# EAGLE schematic Car (EAGLE 7.4.0)
AUTHOR: W. Boyett; REV: A

## Sheet 1 of 4
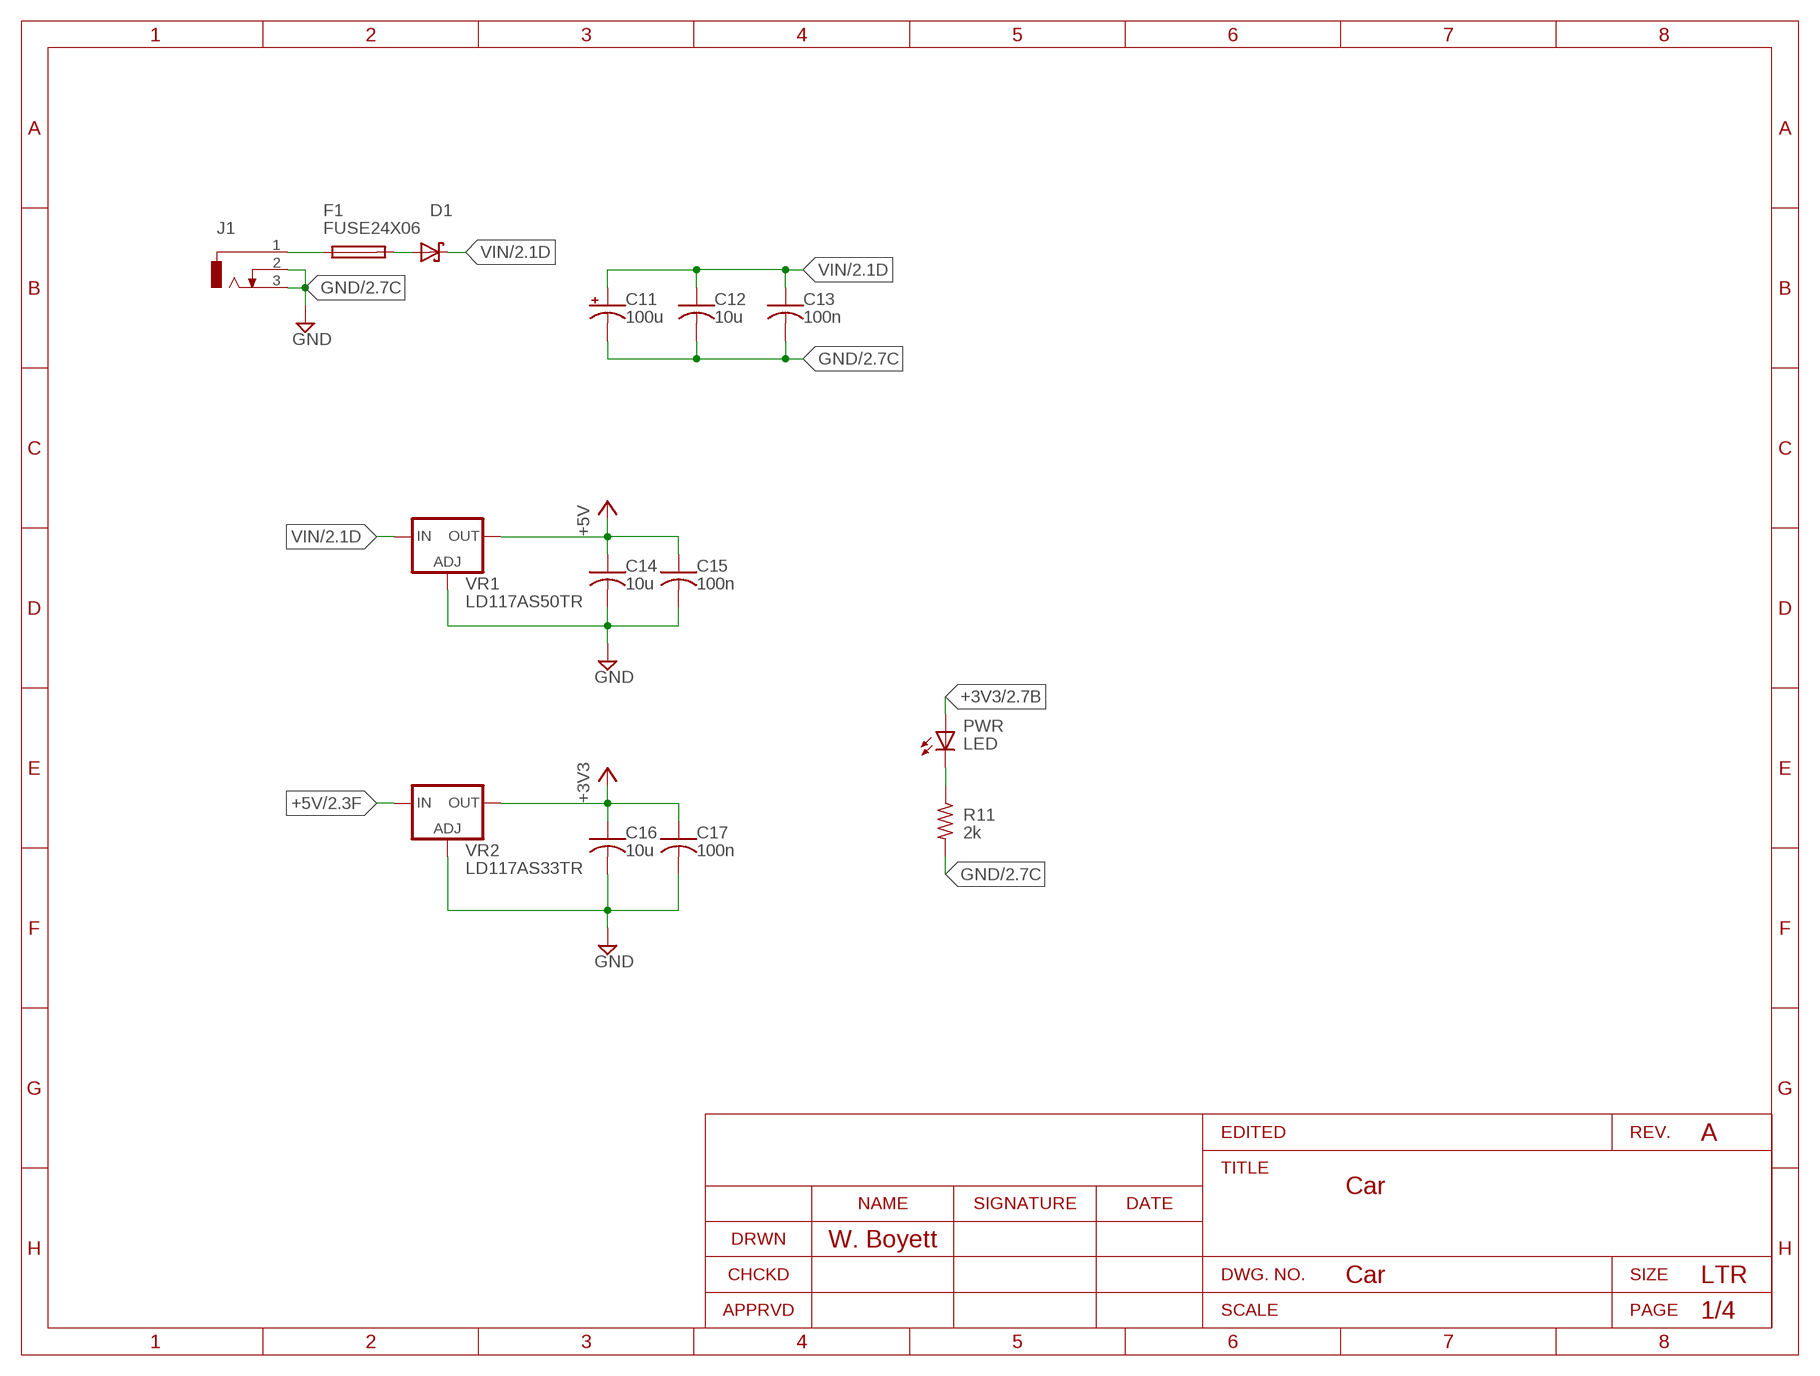
[diagram p0: schematic, sheet 1]
FRAME1 (LETTER_L): SECTION: Power Supply

### Parts
C11  100u  CAP_POLC  [PANASONIC_C]
C12  10u  C-USC1206  [C1206]
C13  100n  C-USC0805  [C0805]
C14  10u  C-USC1206  [C1206]
C15  100n  C-USC0805  [C0805]
C16  10u  C-USC1206  [C1206]
C17  100n  C-USC0805  [C0805]
D1  SCHOTTKY-DIODESMA  [SMA]
F1  FUSE24X06  [2SMD-24X06]
J1  DCJ0303  [DCJ0303]
PWR  LED  LEDCHIP-LED0805  [CHIP-LED0805]
R11  2k  R-US_R0805  [R0805]
VR1  LD117AS50TR  [SOT223]
VR2  LD117AS33TR  [SOT223]

### Nets
+3V3: C16.1 C17.1 PWR.A VR2.2(OUT) VR2.4(OUT) ; also sheet 2,4
+5V: C14.1 C15.1 VR1.2(OUT) VR1.4(OUT) VR2.3(IN) ; also sheet 2,3
GND: C11.- C12.2 C13.2 C14.2 C15.2 C16.2 C17.2 J1.2 J1.3 R11.2 VR1.1(ADJ) VR2.1(ADJ) ; also sheet 2,3,4
N$3: D1.A F1.P$2
N$65: PWR.C R11.1
VIN [power]: C11.+ C12.1 C13.1 D1.C VR1.3(IN) ; also sheet 2,3
VIN_PRF: F1.P$1 J1.1

## Sheet 2 of 4
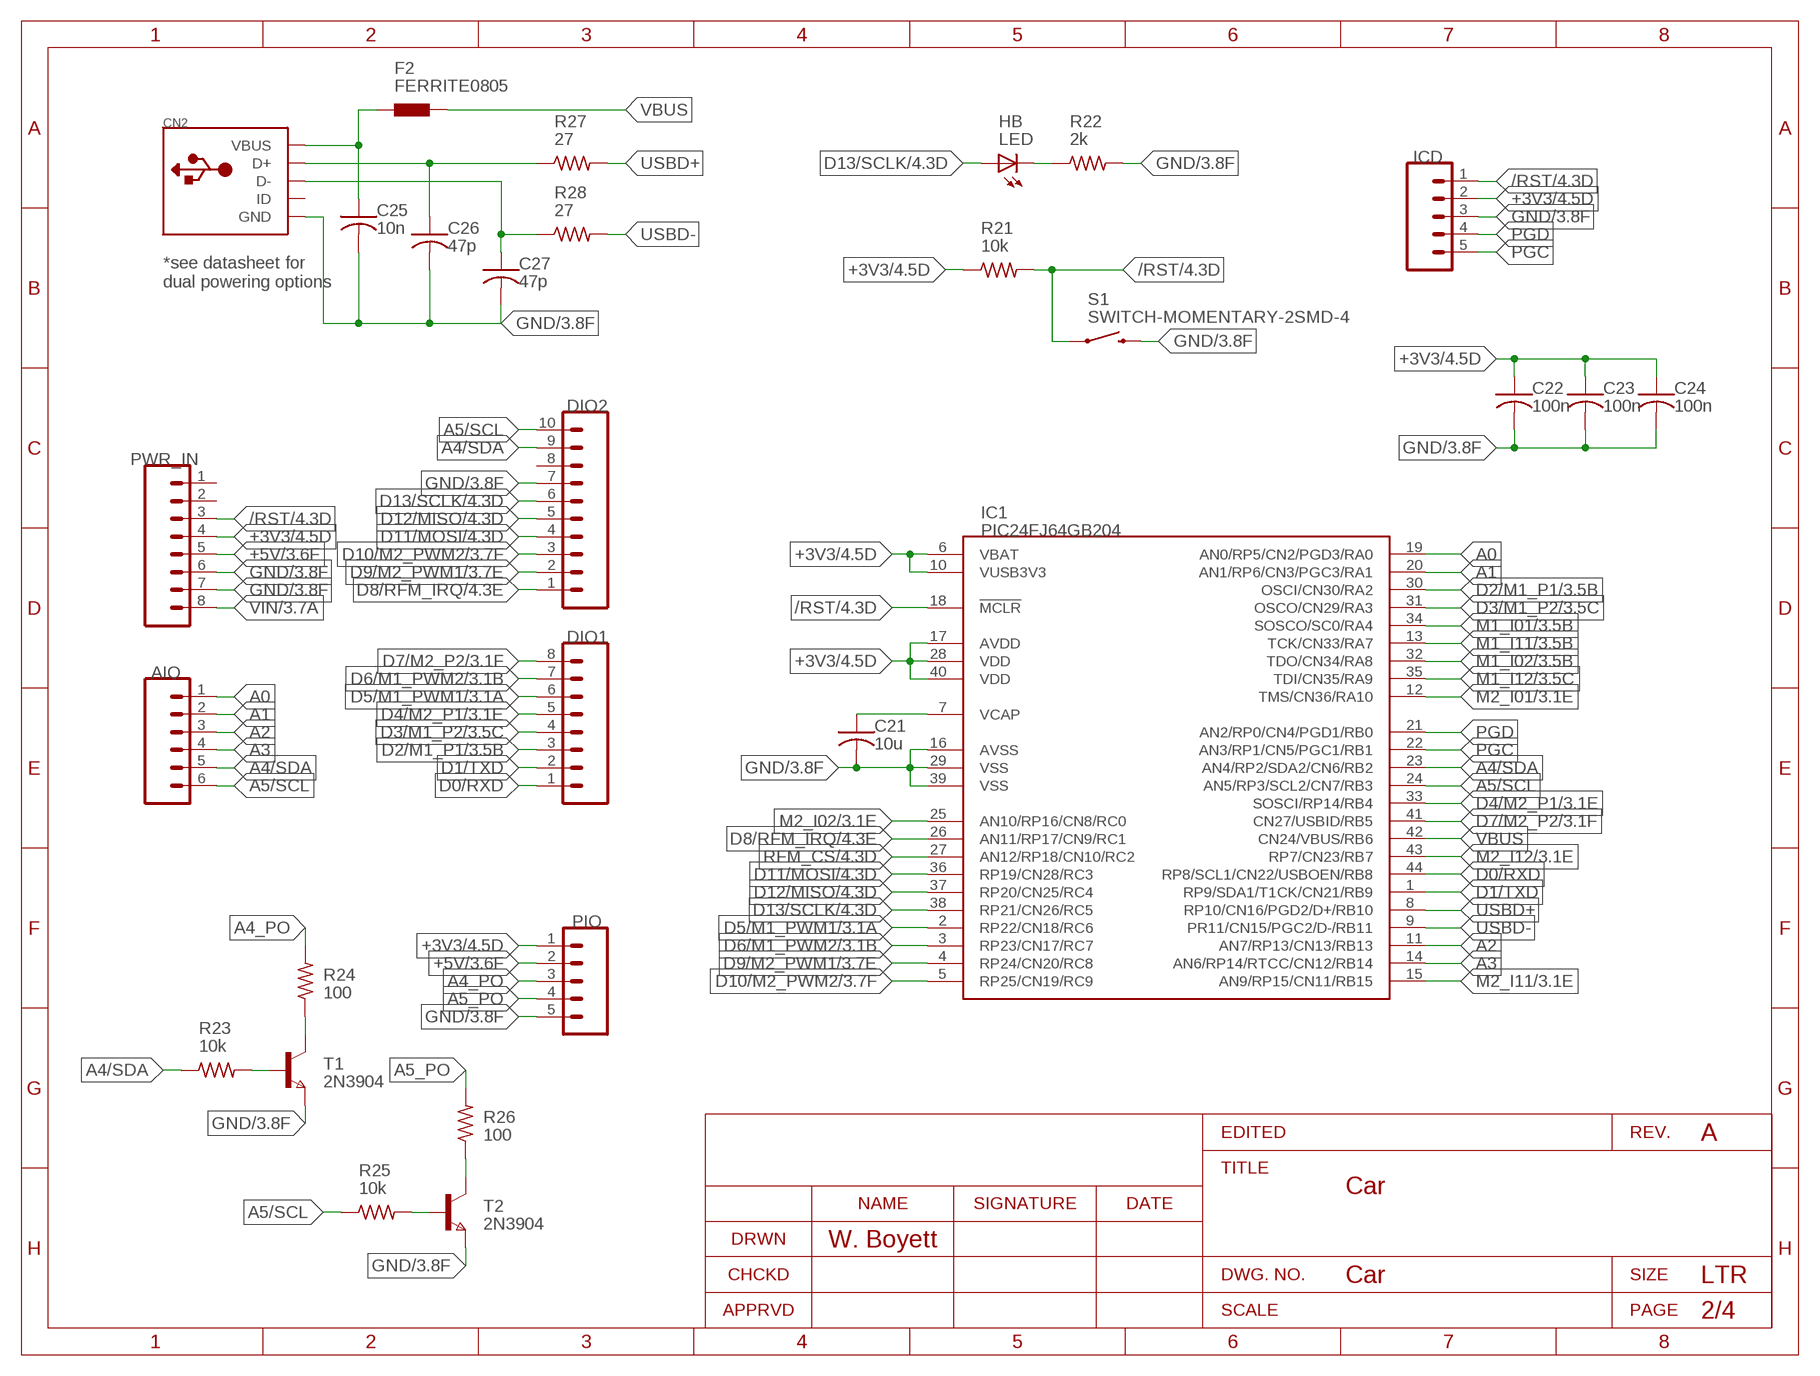
[diagram p1: schematic, sheet 2]
FRAME2 (LETTER_L): SECTION: Microcontroller

### Parts
AIO  M06LOCK  [1X06_LOCK]
C21  10u  C-USC1206  [C1206]
C22  100n  C-USC0805  [C0805]
C23  100n  C-USC0805  [C0805]
C24  100n  C-USC0805  [C0805]
C25  10n  C-USC0805  [C0805]
C26  47p  C-USC0805  [C0805]
C27  47p  C-USC0805  [C0805]
CN2  USBMINIB  [USB-MINIB]
DIO1  M08LOCK  [1X08_LOCK]
DIO2  M10LOCK  [1X10_LOCK]
F2  FERRITE0805  [0805]
HB  LED  LEDCHIP-LED0805  [CHIP-LED0805]
IC1  PIC24FJ64GB204  [TQFP44]
ICD  M05LOCK  [1X05_LOCK]
PIO  M05LOCK  [1X05_LOCK]
PWR_IN  M08LOCK  [1X08_LOCK]
R21  10k  R-US_R0805  [R0805]
R22  2k  R-US_R0805  [R0805]
R23  10k  R-US_R0805  [R0805]
R24  100  R-US_R0805  [R0805]
R25  10k  R-US_R0805  [R0805]
R26  100  R-US_R0805  [R0805]
R27  27  R-US_R0805  [R0805]
R28  27  R-US_R0805  [R0805]
S1  SWITCH-MOMENTARY-2SMD-4  [TACTILE_SWITCH_TALL]
T1  2N3904  NPNSOT23  [SOT-23]
T2  2N3904  NPNSOT23  [SOT-23]

### Nets
+3V3: C22.1 C23.1 C24.1 IC1.6(VBAT) IC1.10(VUSB3V3) IC1.17(AVDD) IC1.28(VDD) IC1.40(VDD) ICD.2 PIO.1 PWR_IN.4 R21.1 ; also sheet 1,4
+5V: PIO.2 PWR_IN.5 ; also sheet 1,3
/RST: IC1.18(!MCLR) ICD.1 PWR_IN.3 R21.2 S1.A2 ; also sheet 4
A0: AIO.1 IC1.19(AN0/RP5/CN2/PGD3/RA0)
A1: AIO.2 IC1.20(AN1/RP6/CN3/PGC3/RA1)
A2: AIO.3 IC1.11(AN7/RP13/CN13/RB13)
A3: AIO.4 IC1.14(AN6/RP14/RTCC/CN12/RB14)
A4/SDA: AIO.5 DIO2.9 IC1.23(AN4/RP2/SDA2/CN6/RB2) R23.1
A4_PO: PIO.3 R24.2
A5/SCL: AIO.6 DIO2.10 IC1.24(AN5/RP3/SCL2/CN7/RB3) R25.1
A5_PO: PIO.4 R26.2
D0/RXD: DIO1.1 IC1.44(RP8/SCL1/CN22/USBOEN/RB8)
D1/TXD: DIO1.2 IC1.1(RP9/SDA1/T1CK/CN21/RB9)
D2/M1_P1: DIO1.3 IC1.30(OSCI/CN30/RA2) ; also sheet 3
D3/M1_P2: DIO1.4 IC1.31(OSCO/CN29/RA3) ; also sheet 3
D4/M2_P1: DIO1.5 IC1.33(SOSCI/RP14/RB4) ; also sheet 3
D5/M1_PWM1: DIO1.6 IC1.2(RP22/CN18/RC6) ; also sheet 3
D6/M1_PWM2: DIO1.7 IC1.3(RP23/CN17/RC7) ; also sheet 3
D7/M2_P2: DIO1.8 IC1.41(CN27/USBID/RB5) ; also sheet 3
D8/RFM_IRQ: DIO2.1 IC1.26(AN11/RP17/CN9/RC1) ; also sheet 4
D9/M2_PWM1: DIO2.2 IC1.4(RP24/CN20/RC8) ; also sheet 3
D10/M2_PWM2: DIO2.3 IC1.5(RP25/CN19/RC9) ; also sheet 3
D11/MOSI: DIO2.4 IC1.36(RP19/CN28/RC3) ; also sheet 4
D12/MISO: DIO2.5 IC1.37(RP20/CN25/RC4) ; also sheet 4
D13/SCLK: DIO2.6 HB.A IC1.38(RP21/CN26/RC5) ; also sheet 4
GND: C21.2 C22.2 C23.2 C24.2 C25.2 C26.2 C27.2 CN2.GND DIO2.7 IC1.16(AVSS) IC1.29(VSS) IC1.39(VSS) ICD.3 PIO.5 PWR_IN.6 PWR_IN.7 R22.2 S1.B2 T1.2(E) T2.2(E) ; also sheet 1,3,4
M1_I01: IC1.34(SOSCO/SC0/RA4) ; also sheet 3
M1_I02: IC1.32(TDO/CN34/RA8) ; also sheet 3
M1_I11: IC1.13(TCK/CN33/RA7) ; also sheet 3
M1_I12: IC1.35(TDI/CN35/RA9) ; also sheet 3
M2_I01: IC1.12(TMS/CN36/RA10) ; also sheet 3
M2_I02: IC1.25(AN10/RP16/CN8/RC0) ; also sheet 3
M2_I11: IC1.15(AN9/RP15/CN11/RB15) ; also sheet 3
M2_I12: IC1.43(RP7/CN23/RB7) ; also sheet 3
N$7: R24.1 T1.1(C)
N$12: R26.1 T2.1(C)
N$19: R23.2 T1.3(B)
N$20: R25.2 T2.3(B)
N$21: C26.1 CN2.D+ R27.1
N$22: C27.1 CN2.D- R28.1
N$40: C21.1 IC1.7(VCAP)
N$46: HB.C R22.1
PGC: IC1.22(AN3/RP1/CN5/PGC1/RB1) ICD.5
PGD: IC1.21(AN2/RP0/CN4/PGD1/RB0) ICD.4
RFM_CS: IC1.27(AN12/RP18/CN10/RC2) ; also sheet 4
USBD+: IC1.8(RP10/CN16/PGD2/D+/RB10) R27.2
USBD-: IC1.9(PR11/CN15/PGC2/D-/RB11) R28.2
VBUS: F2.2 IC1.42(CN24/VBUS/RB6)
VBUS-PRF: C25.1 CN2.VBUS F2.1
VIN [power]: PWR_IN.8 ; also sheet 1,3
Unconnected: CN2.ID DIO2.8 PWR_IN.1 PWR_IN.2

### Notes on the sheet
- *see datasheet for
  dual powering options

## Sheet 3 of 4
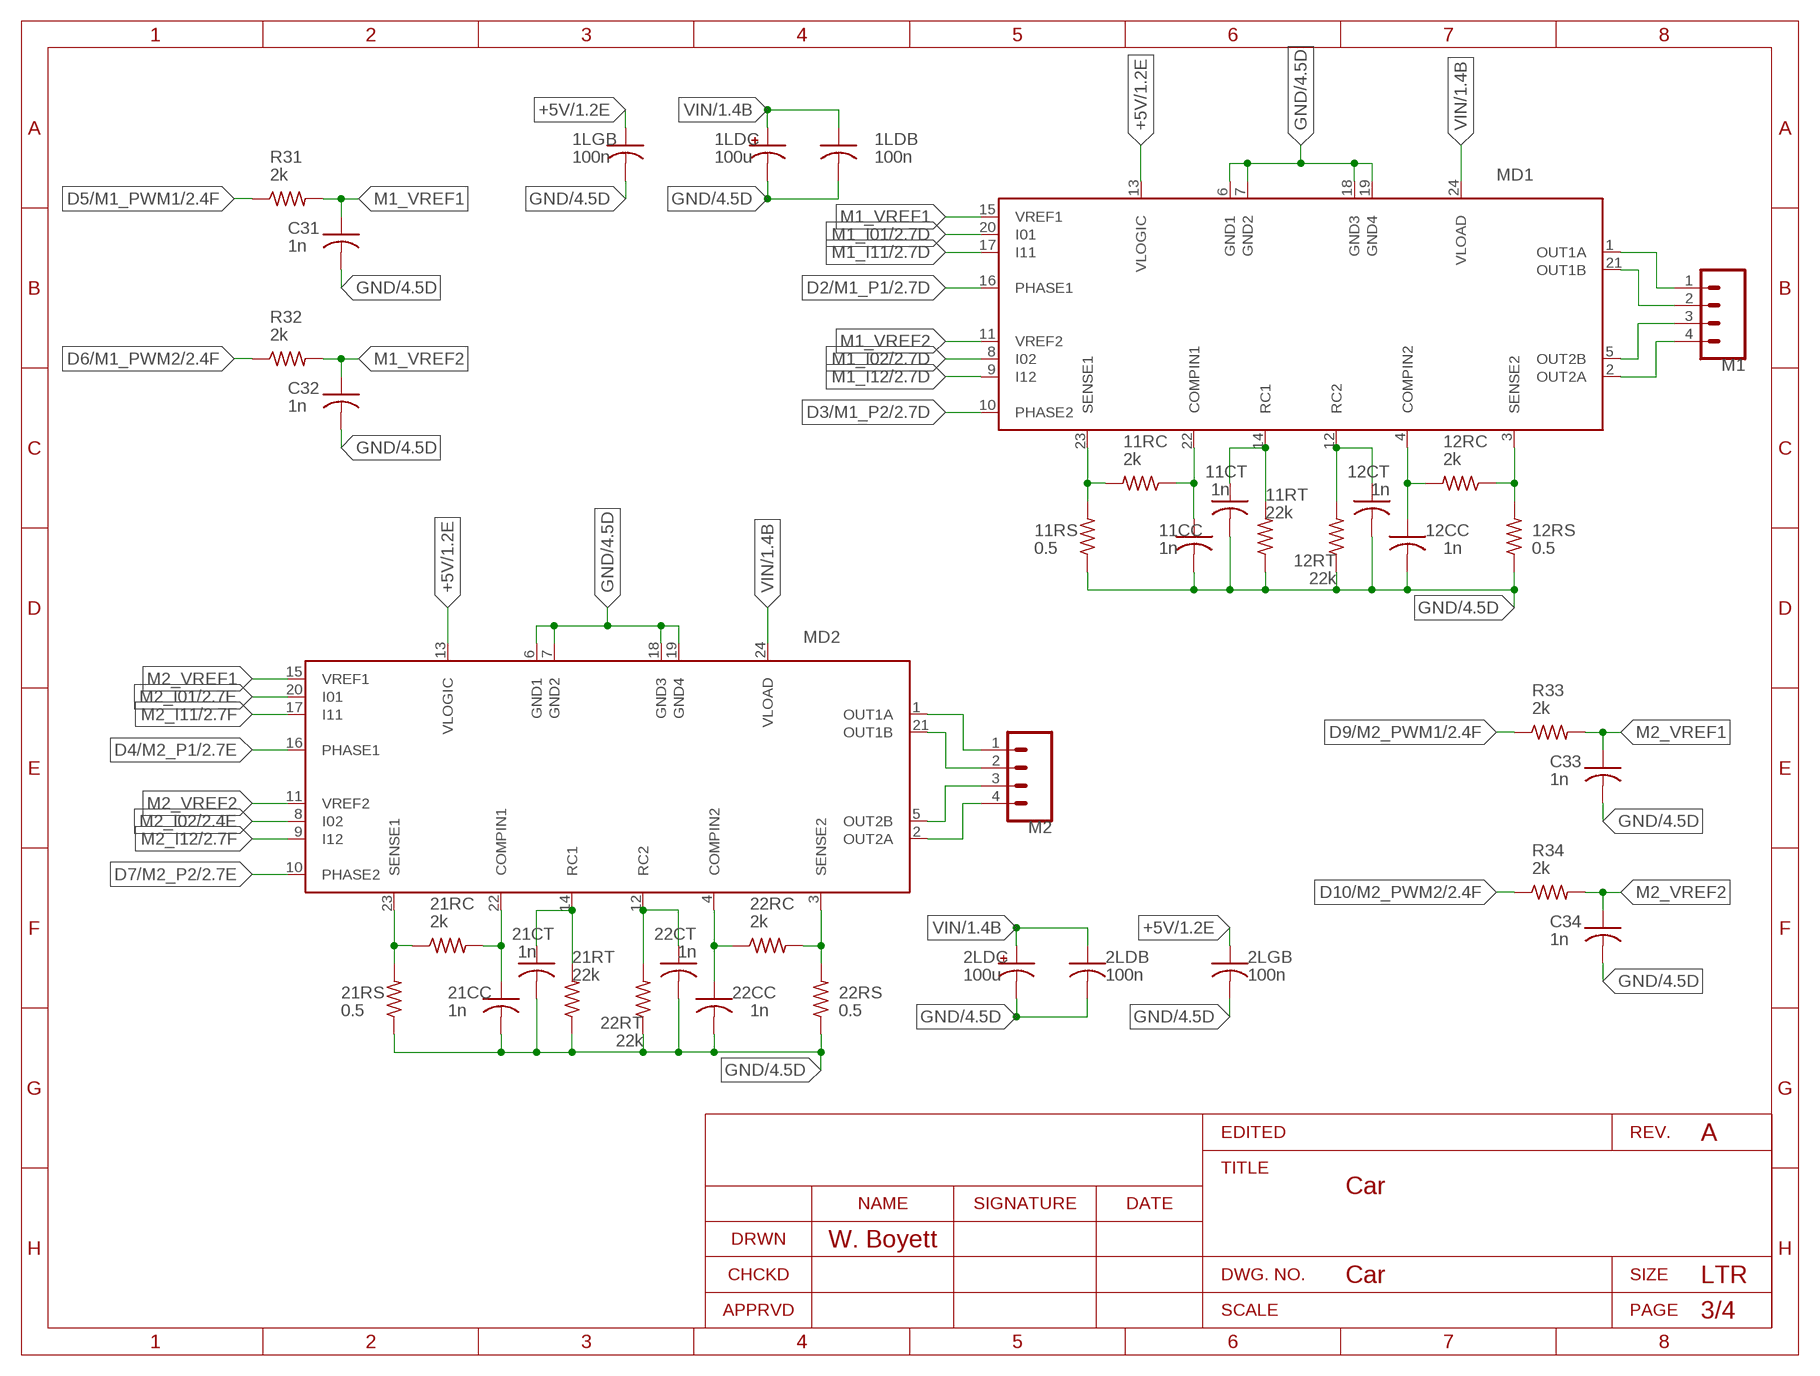
[diagram p2: schematic, sheet 3]
FRAME3 (LETTER_L): SECTION: Motor Driver

### Parts
1LDB  100n  C-USC0805  [C0805]
1LDC  100u  CAP_POLC  [PANASONIC_C]
1LGB  100n  C-USC0805  [C0805]
2LDB  100n  C-USC0805  [C0805]
2LDC  100u  CAP_POLC  [PANASONIC_C]
2LGB  100n  C-USC0805  [C0805]
11CC  1n  C-USC0805  [C0805]
11CT  1n  C-USC0805  [C0805]
11RC  2k  R-US_R0805  [R0805]
11RS  0.5  R-US_R1210  [R1210]
11RT  22k  R-US_R0805  [R0805]
12CC  1n  C-USC0805  [C0805]
12CT  1n  C-USC0805  [C0805]
12RC  2k  R-US_R0805  [R0805]
12RS  0.5  R-US_R1210  [R1210]
12RT  22k  R-US_R0805  [R0805]
21CC  1n  C-USC0805  [C0805]
21CT  1n  C-USC0805  [C0805]
21RC  2k  R-US_R0805  [R0805]
21RS  0.5  R-US_R1210  [R1210]
21RT  22k  R-US_R0805  [R0805]
22CC  1n  C-USC0805  [C0805]
22CT  1n  C-USC0805  [C0805]
22RC  2k  R-US_R0805  [R0805]
22RS  0.5  R-US_R1210  [R1210]
22RT  22k  R-US_R0805  [R0805]
C31  1n  C-USC0805  [C0805]
C32  1n  C-USC0805  [C0805]
C33  1n  C-USC0805  [C0805]
C34  1n  C-USC0805  [C0805]
M1  M04LOCK  [1X04_LOCK]
M2  M04LOCK  [1X04_LOCK]
MD1  MTS62C19A  [SOP24L]
MD2  MTS62C19A  [SOP24L]
R31  2k  R-US_R0805  [R0805]
R32  2k  R-US_R0805  [R0805]
R33  2k  R-US_R0805  [R0805]
R34  2k  R-US_R0805  [R0805]

### Nets
+5V: 1LGB.1 2LGB.1 MD1.13(VLOGIC) MD2.13(VLOGIC) ; also sheet 1,2
D2/M1_P1: MD1.16(PHASE1) ; also sheet 2
D3/M1_P2: MD1.10(PHASE2) ; also sheet 2
D4/M2_P1: MD2.16(PHASE1) ; also sheet 2
D5/M1_PWM1: R31.1 ; also sheet 2
D6/M1_PWM2: R32.1 ; also sheet 2
D7/M2_P2: MD2.10(PHASE2) ; also sheet 2
D9/M2_PWM1: R33.1 ; also sheet 2
D10/M2_PWM2: R34.1 ; also sheet 2
GND: 1LDB.2 1LDC.- 1LGB.2 2LDB.2 2LDC.- 2LGB.2 11CC.2 11CT.2 11RS.1 11RT.1 12CC.2 12CT.2 12RS.1 12RT.1 21CC.2 21CT.2 21RS.1 21RT.1 22CC.2 22CT.2 22RS.1 22RT.1 C31.2 C32.2 C33.2 C34.2 MD1.6(GND1) MD1.7(GND2) MD1.18(GND3) MD1.19(GND4) MD2.6(GND1) MD2.7(GND2) MD2.18(GND3) MD2.19(GND4) ; also sheet 1,2,4
M1_I01: MD1.20(I01) ; also sheet 2
M1_I02: MD1.8(I02) ; also sheet 2
M1_I11: MD1.17(I11) ; also sheet 2
M1_I12: MD1.9(I12) ; also sheet 2
M1_VREF1: C31.1 MD1.15(VREF1) R31.2
M1_VREF2: C32.1 MD1.11(VREF2) R32.2
M2_I01: MD2.20(I01) ; also sheet 2
M2_I02: MD2.8(I02) ; also sheet 2
M2_I11: MD2.17(I11) ; also sheet 2
M2_I12: MD2.9(I12) ; also sheet 2
M2_VREF1: C33.1 MD2.15(VREF1) R33.2
M2_VREF2: C34.1 MD2.11(VREF2) R34.2
N$1 [power]: M1.2 MD1.21(OUT1B)
N$2 [power]: M1.1 MD1.1(OUT1A)
N$4 [power]: M1.3 MD1.5(OUT2B)
N$5 [power]: M1.4 MD1.2(OUT2A)
N$6 [power]: M2.2 MD2.21(OUT1B)
N$8 [power]: M2.1 MD2.1(OUT1A)
N$9 [power]: M2.3 MD2.5(OUT2B)
N$10 [power]: M2.4 MD2.2(OUT2A)
N$13 [power]: 21RC.1 21RS.2 MD2.23(SENSE1)
N$14: 21CC.1 21RC.2 MD2.22(COMPIN1)
N$15: 22CT.1 22RT.2 MD2.12(RC2)
N$16 [power]: 22RC.2 22RS.2 MD2.3(SENSE2)
N$17: 22CC.1 22RC.1 MD2.4(COMPIN2)
N$18: 21CT.1 21RT.2 MD2.14(RC1)
N$31 [power]: 11RC.2 11RS.2 MD1.23(SENSE1)
N$33: 11CC.1 11RC.1 MD1.22(COMPIN1)
N$34: 12CC.1 12RC.2 MD1.4(COMPIN2)
N$35 [power]: 12RC.1 12RS.2 MD1.3(SENSE2)
N$41: 11CT.1 11RT.2 MD1.14(RC1)
N$42: 12CT.1 12RT.2 MD1.12(RC2)
VIN [power]: 1LDB.1 1LDC.+ 2LDB.1 2LDC.+ MD1.24(VLOAD) MD2.24(VLOAD) ; also sheet 1,2

## Sheet 4 of 4
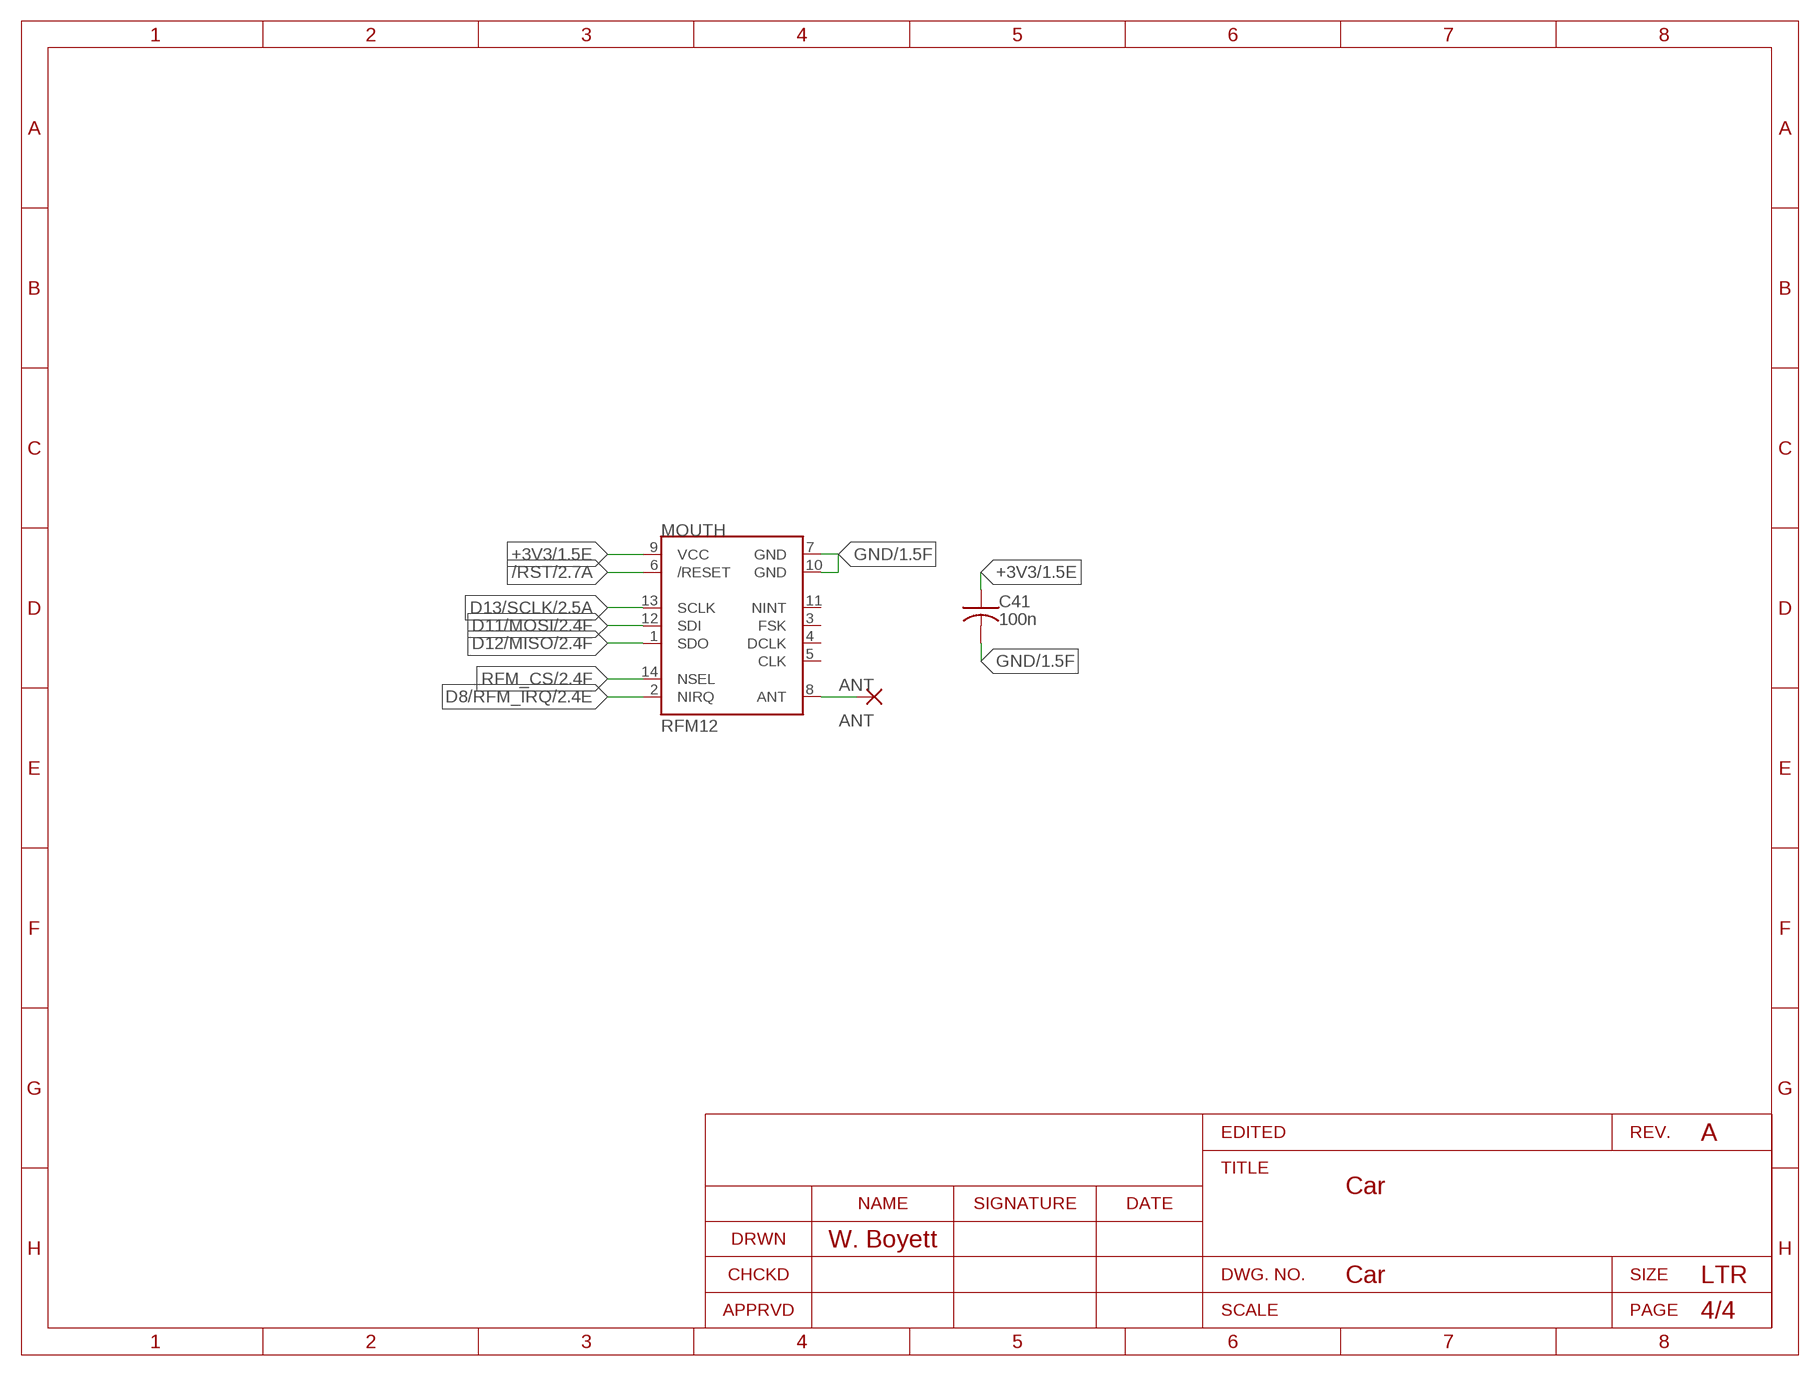
[diagram p3: schematic, sheet 4]
FRAME4 (LETTER_L): SECTION: Comms

### Parts
ANT  ANT  2,15/1,0  [2,15/1,0]
C41  100n  C-USC0805  [C0805]
MOUTH  RFM12  [RFM12-XXX-S2]

### Nets
+3V3: C41.1 MOUTH.9(VCC) ; also sheet 1,2
/RST: MOUTH.6(/RESET) ; also sheet 2
D8/RFM_IRQ: MOUTH.2(NIRQ) ; also sheet 2
D11/MOSI: MOUTH.12(SDI) ; also sheet 2
D12/MISO: MOUTH.1(SDO) ; also sheet 2
D13/SCLK: MOUTH.13(SCLK) ; also sheet 2
GND: C41.2 MOUTH.7(GND) MOUTH.10(GND) ; also sheet 1,2,3
N$11: ANT.1(P) MOUTH.8(ANT)
RFM_CS: MOUTH.14(NSEL) ; also sheet 2
Unconnected: MOUTH.3(FSK) MOUTH.4(DCLK) MOUTH.5(CLK) MOUTH.11(NINT)

## Library data of the parts
1LDB 1LGB 2LDB 2LGB 11CC 11CT 12CC 12CT 21CC 21CT 22CC 22CT C13 C15 C17 C22-C24 C31-C34 C41 = rcl:C-US: CAPACITOR, American symbol; PN-DK: 478-1395-1-ND
1LDC 2LDC C11 = SparkFun-Passives:CAP_POL: Capacitor Polarized These are standard SMD and PTH capacitors. Normally 10uF, 47uF, and 100uF in electrolytic and tantalum varieties. Always verify the external diameter of the through hole cap, it varies with capacity, voltage, and manufacturer. The EIA devices should be standard.
11RC 11RT 12RC 12RT 21RC 21RT 22RC 22RT R11 R21-R26 R31-R34 = rcl:R-US_: RESISTOR, American symbol
11RS 12RS 21RS 22RS = resistor:R-US_: RESISTOR, American symbol
AIO = SparkFun-Connectors:M06: Header 6 Standard 6-pin 0.1" header. Use with straight break away headers (SKU : PRT-00116), right angle break away headers (PRT-00553), swiss pins (PRT-00743), machine pins (PRT-00117), and female headers (PRT-00115). Molex polarized connector foot print use with SKU : PRT-08094 with associated crimp pins and housings. NOTES ON THE VARIANTS LOCK and LOCK_LONGPADS... This footprint was designed to help hold the alignment of a through-hole component (i.e. 6-pin header) while soldering it into place. You may notice that each hole has been shifted either up or down by 0.005 of an inch from it's more standard position (which is a perfectly straight line). This slight alteration caused the pins (the squares in the middle) to touch the edges of the holes. Because they are alternating, it causes a "brace" to hold the component in place. 0.005 has proven to be the perfect amount of "off-center" position when using our standard breakaway headers. Although looks a little odd when you look at the bare footprint, once you have a header in there, the alteration is very hard to notice. Also,if you push a header all the way into place, it is covered up entirely on the bottom side. This idea of altering the position of holes to aid alignment will be further integrated into the Sparkfun Library for other footprints. It can help hold any component with 3 or more connection pins.
ANT = wirepad:2,15/1,0: THROUGH-HOLE PAD
C12 C14 C16 C21 = rcl:C-US: CAPACITOR, American symbol; PN-DK: 587-2484-1-ND
C25 = rcl:C-US: CAPACITOR, American symbol; PN-DK: 399-1158-1-ND
C26 C27 = rcl:C-US: CAPACITOR, American symbol; PN-DK: 399-1117-1-ND
CN2 = adafruit:USB: USB Connectors USBMINIB - Surface Mount Female Mini-B USB Connector 4UConnector: 06564 By microbuilder.eu Thru-hole RA Female Mini-B USB Connector 4UConnector: 18732 By ladyada.net; PN-DK: 151-1206-1-ND
D1 = SmslsTron-1:SCHOTTKY-DIODE: Schottky Diode; PN-DK: SBRT5A50SA-13DICT-ND
DIO1 PWR_IN = SparkFun-Connectors:M08: Header 8 Standard 8-pin 0.1" header. Use with straight break away headers (SKU : PRT-00116), right angle break away headers (PRT-00553), swiss pins (PRT-00743), machine pins (PRT-00117), and female headers (PRT-00115).
DIO2 = SparkFun-Connectors:M10: Header 10 Standard 10-pin 0.1" header. Use with straight break away headers (SKU : PRT-00116), right angle break away headers (PRT-00553), swiss pins (PRT-00743), machine pins (PRT-00117), and female headers (PRT-00115).
F1 = SmslsTron-1:FUSE; PN-DK: F6634CT-ND
F2 = SMSLS:FERRITE; PN-DK: 490-1054-1-ND
HB PWR = led:LED: LED OSRAM: - CHIPLED LG R971, LG N971, LY N971, LG Q971, LY Q971, LO R971, LY R971 LH N974, LH R974 LS Q976, LO Q976, LY Q976 LO Q996 - Hyper CHIPLED LW Q18S LB Q993, LB Q99A, LB R99A - SideLED LS A670, LO A670, LY A670, LG A670, LP A670 LB A673, LV A673, LT A673, LW A673 LH A674 LY A675 LS A676, LA A676, LO A676, LY A676, LW A676 LS A679, LY A679, LG A679 - Hyper Micro SIDELED® LS Y876, LA Y876, LO Y876, LY Y876 LT Y87S - SmartLED LW L88C, LW L88S LB L89C, LB L89S, LG L890 LS L89K, LO L89K, LY L89K LS L896, LA L896, LO L896, LY L896 - TOPLED LS T670, LO T670, LY T670, LG T670, LP T670 LSG T670, LSP T670, LSY T670, LOP T670, LYG T670 LG T671, LOG T671, LSG T671 LB T673, LV T673, LT T673, LW T673 LH T674 LS T676, LA T676, LO T676, LY T676, LB T676, LH T676, LSB T676, LW T676 LB T67C, LV T67C, LT T67C, LS T67K, LO T67K, LY T67K, LW E67C LS E67B, LA E67B, LO E67B, LY E67B, LB E67C, LV E67C, LT E67C LW T67C LS T679, LY T679, LG T679 LS T770, LO T770, LY T770, LG T770, LP T770 LB T773, LV T773, LT T773, LW T773 LH T774 LS E675, LA E675, LY E675, LS T675 LS T776, LA T776, LO T776, LY T776, LB T776 LHGB T686 LT T68C, LB T68C - Hyper Mini TOPLED® LB M676 - Mini TOPLED Santana® LG M470 LS M47K, LO M47K, LY M47K Source: http://www.osram.convergy.de LUXEON: - LUMILED® LXK2-PW12-R00, LXK2-PW12-S00, LXK2-PW14-U00, LXK2-PW14-V00 LXK2-PM12-R00, LXK2-PM12-S00, LXK2-PM14-U00 LXK2-PE12-Q00, LXK2-PE12-R00, LXK2-PE12-S00, LXK2-PE14-T00, LXK2-PE14-U00 LXK2-PB12-K00, LXK2-PB12-L00, LXK2-PB12-M00, LXK2-PB14-N00, LXK2-PB14-P00, LXK2-PB14-Q00 LXK2-PR12-L00, LXK2-PR12-M00, LXK2-PR14-Q00, LXK2-PR14-R00 LXK2-PD12-Q00, LXK2-PD12-R00, LXK2-PD12-S00 LXK2-PH12-R00, LXK2-PH12-S00 LXK2-PL12-P00, LXK2-PL12-Q00, LXK2-PL12-R00 Source: www.luxeon.com KINGBRIGHT: KA-3528ASYC Source: www.kingbright.com
IC1 = microchip:PIC24FJ64GB204: PIC24FJ64GA004 edit this description Auto generated by make-symbol-device-package-bsdl.ulp Rev. 25 Source: PIC24FJ64GA004.bsd; MPN: PIC24FJ64GA004-E/PT; OC_FARNELL: 1332299; OC_NEWARK: 98M1927
ICD PIO = SparkFun-Connectors:M05: Header 5 Standard 5-pin 0.1" header. Use with straight break away headers (SKU : PRT-00116), right angle break away headers (PRT-00553), swiss pins (PRT-00743), machine pins (PRT-00117), and female headers (PRT-00115). Molex polarized connector foot print use with SKU : PRT-08230 with associated crimp pins and housings.
J1 = con-jack:DCJ0303: DC POWER JACK Source: DCJ0303.pdf; PN-DK: CP-102AH-ND
M1 M2 = SparkFun-Connectors:M04: Header 4 Standard 4-pin 0.1" header. Use with straight break away headers (SKU : PRT-00116), right angle break away headers (PRT-00553), swiss pins (PRT-00743), machine pins (PRT-00117), and female headers (PRT-00115). Molex polarized connector foot print use with SKU : PRT-08231 with associated crimp pins and housings. 1MM SMD Version SKU: PRT-10208
MD1 MD2 = microchip:MTS62C19A
MOUTH = SparkFun-RF:RFM12
R27 R28 = resistor:R-US_: RESISTOR, American symbol; PN-DK: 311-27.0CRCT-ND
S1 = SmslsTron-1:SWITCH-MOMENTARY-2: Various NO switches- pushbuttons, reed, etc; PROD_ID: SWCH-11966
T1 T2 = SmslsTron-1:NPNSOT23: NPN TRANSISTOR; MPN: DSS20201L-7; PN-DK: MMBT2222A-FDICT-ND
VR1 VR2 = v-reg:LD117A?*: Low drop fixed and adjustable positive voltage regulators 1 A Source: http://www.st.com/stonline/products/literature/ds/7194/ld1117axx.pdf

## Net classes
1 power: width 0.762 mm, drill 0.508 mm, clearance 0.762 mm
2 ground: width 0.508 mm, drill 0.381 mm